# EAGLE design Xadow-Basic-Sensors-v1.0 (EAGLE 6.4)
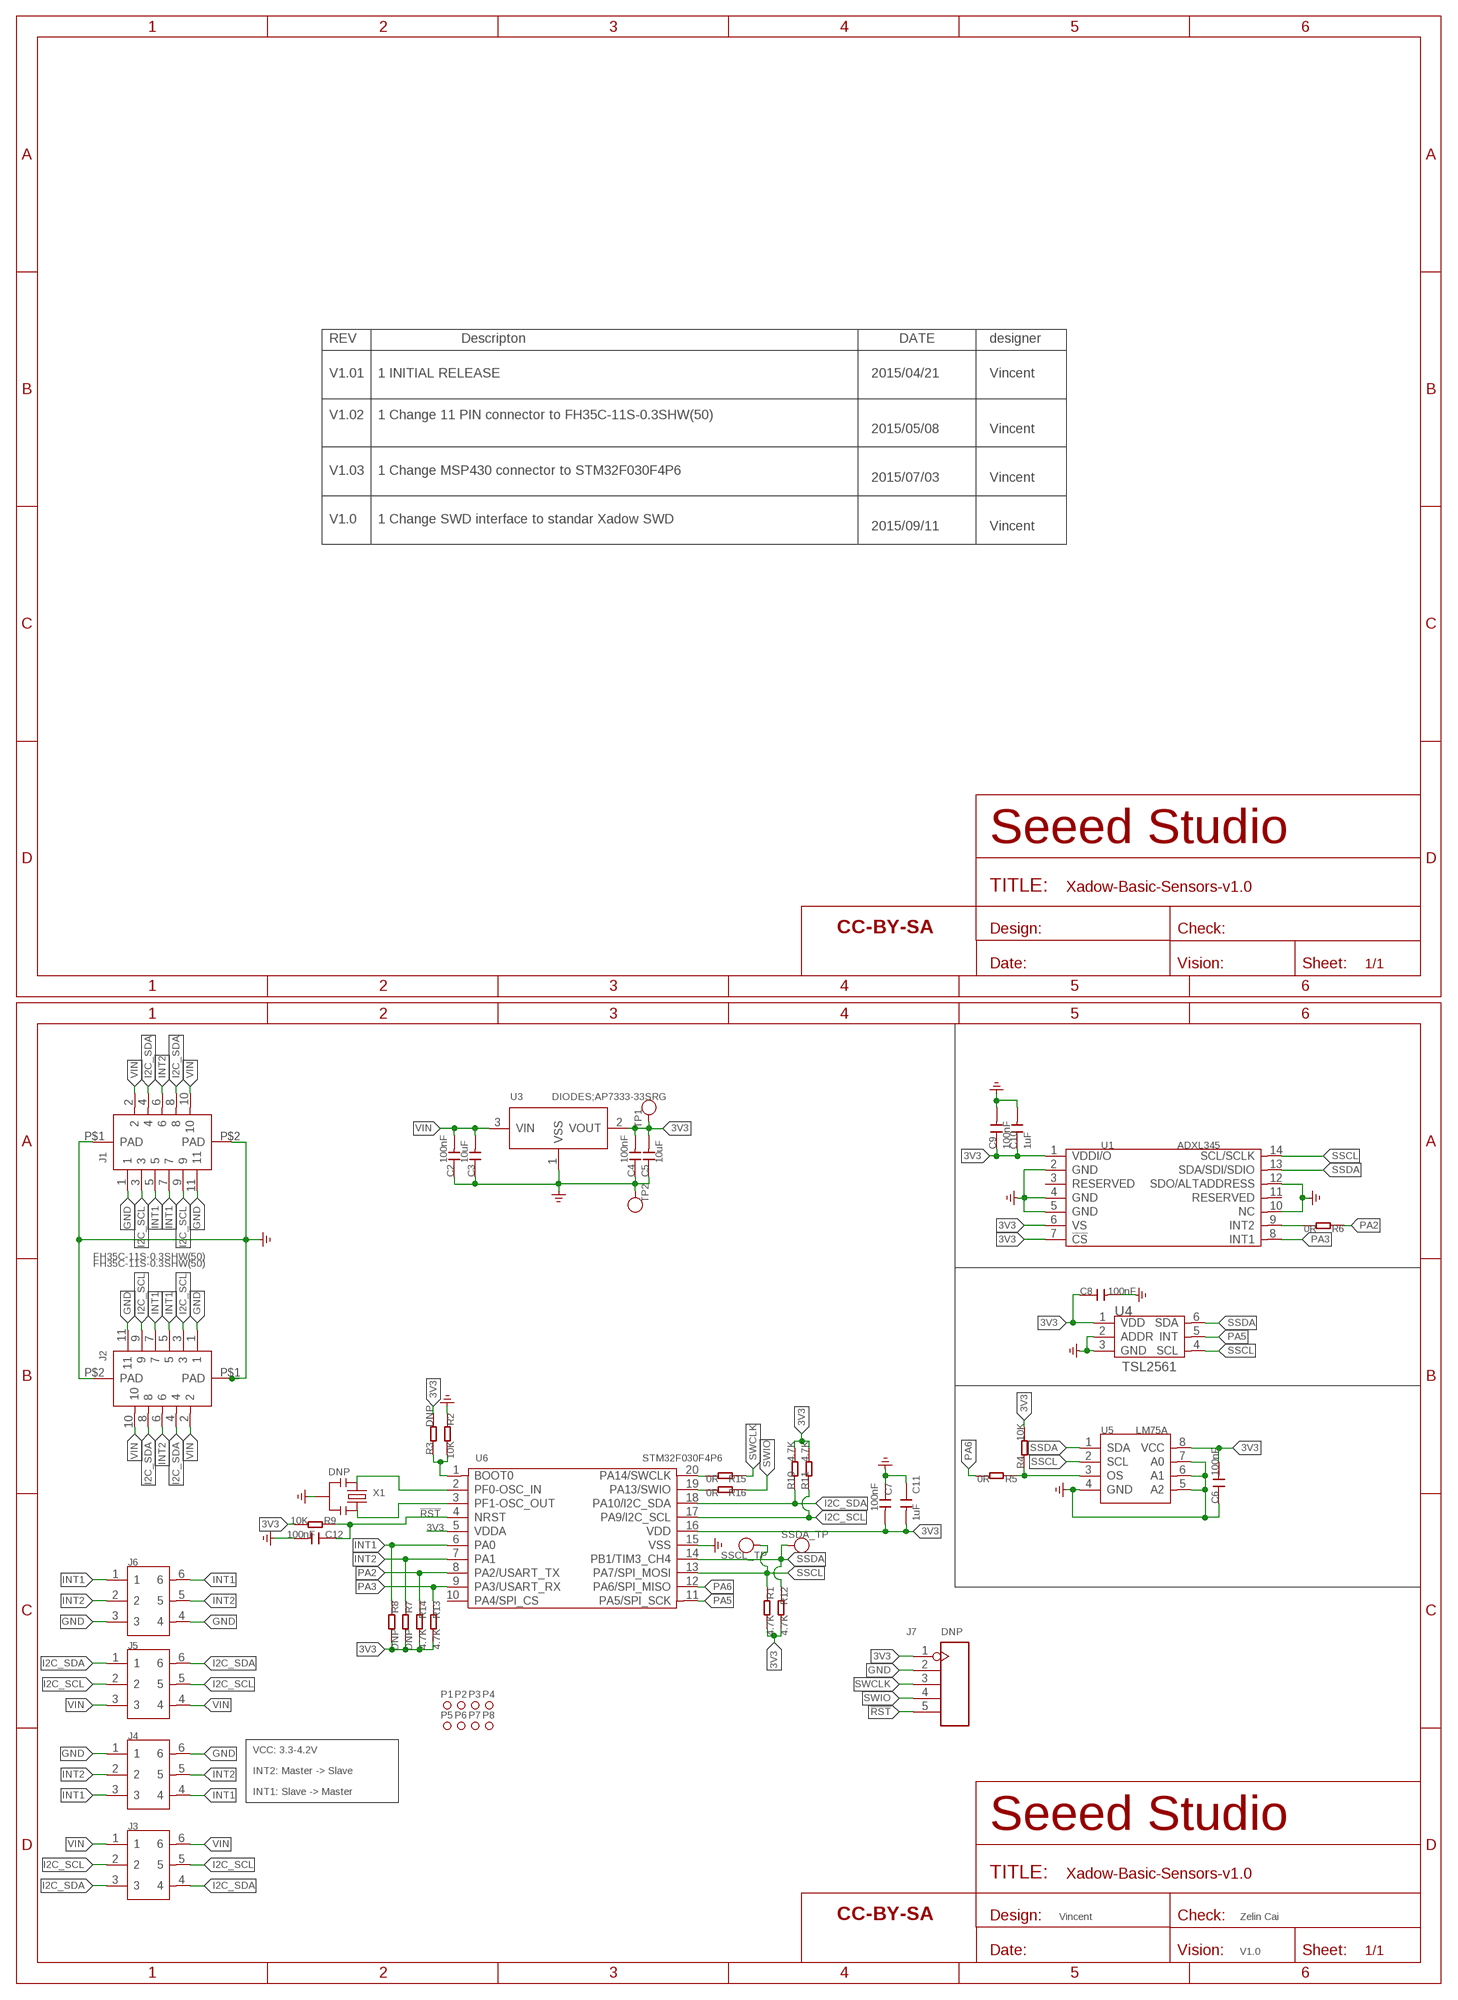
[diagram p0: schematic, sheet 1]

## Parts
C2  100nF  CAP-0402  [C0402]
C3  10uF  CAP-0603  [C0603]
C4  100nF  CAP-0402  [C0402]
C5  10uF  CAP-0603  [C0603]
C6  100nF  CAP-0402  [C0402]
C7  100nF  CAP-0402  [C0402]
C8  100nF  CAP-0402  [C0402]
C9  100nF  CAP-0402  [C0402]
C10  1uF  CAP-0402  [C0402]
C11  1uF  CAP-0402  [C0402]
C12  100nF  CAP-0402  [C0402]
FR1  SEEEDSTUDIO-OPEN-SCH-FRAME  [SEEEDSTUDIO-PCB-FRAME]
J1  FH35C-11S-0.3SHW(50)  FPC-CONNECTER-11P(FH35C-11S-0.3SHW(50))  [FPC11-SMD-0.3(FH35C)]
J2  FH35C-11S-0.3SHW(50)  FPC-CONNECTER-11P(FH35C-11S-0.3SHW(50))  [FPC11-SMD-0.3(FH35C)]
J3  HEADER6_S3  [6P-DIP-2_S3]
J4  HEADER6_ROUND  [6P-DIP-2_ROUND]
J5  HEADER6  [6P-DIP-2]
J6  HEADER6_ROUND  [6P-DIP-2_ROUND]
J7  DNP  HEADER-5PTEST  [H5-SMD-2.0-TEST]
P1  MARK-1.0'ANNULAR'  [ROUND-MARK-1.0]
P2  MARK-1.0'ANNULAR'  [ROUND-MARK-1.0]
P3  MARK-1.0'ANNULAR'  [ROUND-MARK-1.0]
P4  MARK-1.0'ANNULAR'  [ROUND-MARK-1.0]
P5  MARK-1.0'ANNULAR'  [ROUND-MARK-1.0]
P6  MARK-1.0'ANNULAR'  [ROUND-MARK-1.0]
P7  MARK-1.0'ANNULAR'  [ROUND-MARK-1.0]
P8  MARK-1.0'ANNULAR'  [ROUND-MARK-1.0]
R1  4.7K  RES-0402  [R0402]
R2  10K  RES-0402  [R0402]
R3  DNP  RES-0402  [R0402]
R4  10K  RES-0402  [R0402]
R5  0R  RES-0402  [R0402]
R6  0R  RES-0402  [R0402]
R7  DNP  RES-0402  [R0402]
R8  DNP  RES-0402  [R0402]
R9  10K  RES-0402  [R0402]
R10  4.7K  RES-0402  [R0402]
R11  4.7K  RES-0402  [R0402]
R12  4.7K  RES-0402  [R0402]
R13  4.7K  RES-0402  [R0402]
R14  4.7K  RES-0402  [R0402]
R15  0R  RES-0402  [R0402]
R16  0R  RES-0402  [R0402]
SSCL_TP  TEST-POINT'4545'  [TP-D45MIL]
SSDA_TP  TEST-POINT'4545'  [TP-D45MIL]
TP1  TEST-POINT'4545'  [TP-D45MIL]
TP2  TEST-POINT'4545'  [TP-D45MIL]
U1  ADXL345  SENSOR_ADXL345  [LGA14]
U3  DIODES;AP7333-33SRG  PMIC-XC6206PMR  [SOT-23]
U4  TSL2561  TSL2561T  [TMB-6]
U5  LM75A  SENSOR-LM75A  [TSSOP8-0.65-3X3MM]
U6  STM32F030F4P6  MCU-STM32F030  [TSSOP20-0.65-6.5X4.4MM]
U$2  SEEEDSTUDIO-OPEN-SCH-FRAME  [SEEEDSTUDIO-PCB-FRAME]
X1  DNP  CRYSTAL-RESONATOR'SMD'  [RESONATOR3-SMD-3.6X1.3X0.8MM]

## Nets
3V3: C4.2 C5.2 C6.2 C7.2 C8.1 C9.1 C10.1 C11.2 J7.1 R1.2 R3.2 R4.2 R7.2 R8.2 R9.2 R10.2 R11.2 R12.2 R13.2 R14.2 TP1.T U1.1(VDDI/O) U1.6(VS) U1.7(!CS) U3.2(VOUT) U4.1(VDD) U5.8(VCC) U6.5(VDDA) U6.16(VDD)
!RST: C12.1 J7.5 R9.1 U6.4(NRST)
GND: C2.1 C3.1 C4.1 C5.1 C6.1 C7.1 C8.2 C9.2 C10.2 C11.1 C12.2 J1.1 J1.11 J1.P$1(PAD) J1.P$2(PAD) J2.1 J2.11 J2.P$1(PAD) J2.P$2(PAD) J4.1 J4.6 J6.3 J6.4 J7.2 R2.1 TP2.T U1.2(GND) U1.4(GND) U1.5(GND) U1.10(NC) U1.12(SDO/ALTADDRESS) U3.1(VSS) U4.2(ADDR) U4.3(GND) U5.4(GND) U5.5(A2) U5.6(A1) U5.7(A0) U6.15(VSS) X1.2 ; supply symbol labelled GND_POWER
I2C_SCL: J1.3 J1.9 J2.3 J2.9 J3.2 J3.5 J5.2 J5.5 R11.1 U6.17(PA9/I2C_SCL)
I2C_SDA: J1.4 J1.8 J2.4 J2.8 J3.3 J3.4 J5.1 J5.6 R10.1 U6.18(PA10/I2C_SDA)
INT1: J1.5 J1.7 J2.5 J2.7 J4.3 J4.4 J6.1 J6.6 R8.1 U6.6(PA0)
INT2: J1.6 J2.6 J4.2 J4.5 J6.2 J6.5 R7.1 U6.7(PA1)
N$1: R6.2 U1.9(INT2)
N$2: U6.2(PF0-OSC_IN) X1.3
N$3: R4.1 R5.1 U5.3(OS)
N$4: U6.3(PF1-OSC_OUT) X1.1
N$6: R2.2 R3.1 U6.1(BOOT0)
N$7: R15.2 U6.20(PA14/SWCLK)
N$8: R16.2 U6.19(PA13/SWIO)
PA2: R6.1 R14.1 U6.8(PA2/USART_TX)
PA3: R13.1 U1.8(INT1) U6.9(PA3/USART_RX)
PA5: U4.5(INT) U6.11(PA5/SPI_SCK)
PA6: R5.2 U6.12(PA6/SPI_MISO)
SSCL: R1.1 SSCL_TP.T U1.14(SCL/SCLK) U4.4(SCL) U5.2(SCL) U6.13(PA7/SPI_MOSI)
SSDA: R12.1 SSDA_TP.T U1.13(SDA/SDI/SDIO) U4.6(SDA) U5.1(SDA) U6.14(PB1/TIM3_CH4)
SWCLK: J7.3 R15.1
SWIO: J7.4 R16.1
VIN: C2.2 C3.2 J1.2 J1.10 J2.2 J2.10 J3.1 J3.6 J5.3 J5.4 U3.3(VIN)
Unconnected: U1.3(RESERVED) U1.11(RESERVED) U6.10(PA4/SPI_CS)

## Notes on the sheet
- REV | Descripton | DATE | designer
- V1.01 | 1 INITIAL RELEASE | 2015/04/21 | Vincent
- V1.02 | 1 Change 11 PIN connector to FH35C-11S-0.3SHW(50)
- 2015/05/08 | Vincent
- V1.03 | 1 Change MSP430 connector to STM32F030F4P6
- 2015/07/03 | Vincent
- V1.0 | 1 Change SWD interface to standar Xadow SWD
- 2015/09/11 | Vincent
- VCC: 3.3-4.2V
- INT2: Master -> Slave
- INT1: Slave -> Master
- Vincent | Zelin Cai
- V1.0

## Library data of the parts
C2-C12 = Discrete-new:CAP: Ceramic Capacitors
FR1 U$2 = moudle-new:SEEEDSTUDIO-OPEN-SCH-FRAME
J1 J2 = template:FPC-CONNECTER-11P(FH35C-11S-0.3SHW(50))
J3 = Connector:HEADER6_S3
J4 J6 = template:HEADER6_ROUND
J5 = template:HEADER6
J7 = Connector-new:HEADER-5P
P1-P8 = Discrete-new:MARK-1.0; PARTNO: DNP
R1-R16 = Discrete-new:RES
SSCL_TP SSDA_TP TP1 TP2 = Discrete-new:TEST-POINT; PARTNO: DNP
U1 = template:SENSOR_ADXL345: 314080008
U3 = IC-new:PMIC-XC6206P: LOW ESR Cap.Compatible Positive Voltage Regulators
U4 = template:TSL2561: Light-TO-Digital Converter
U5 = template:SENSOR-LM75A: Digital temperature sensor and thermal watchdog
U6 = IC-new:MCU-STM32F030
X1 = Discrete-new:CRYSTAL-RESONATOR: Resonator Small SMD resonator. This is the itty bitty 10/20MHz resonators with built in caps. CSTCE10M0G55 and CSTCE20M0V53. Footprint has been reviewed closely but hasn't been tested yet.

## Board
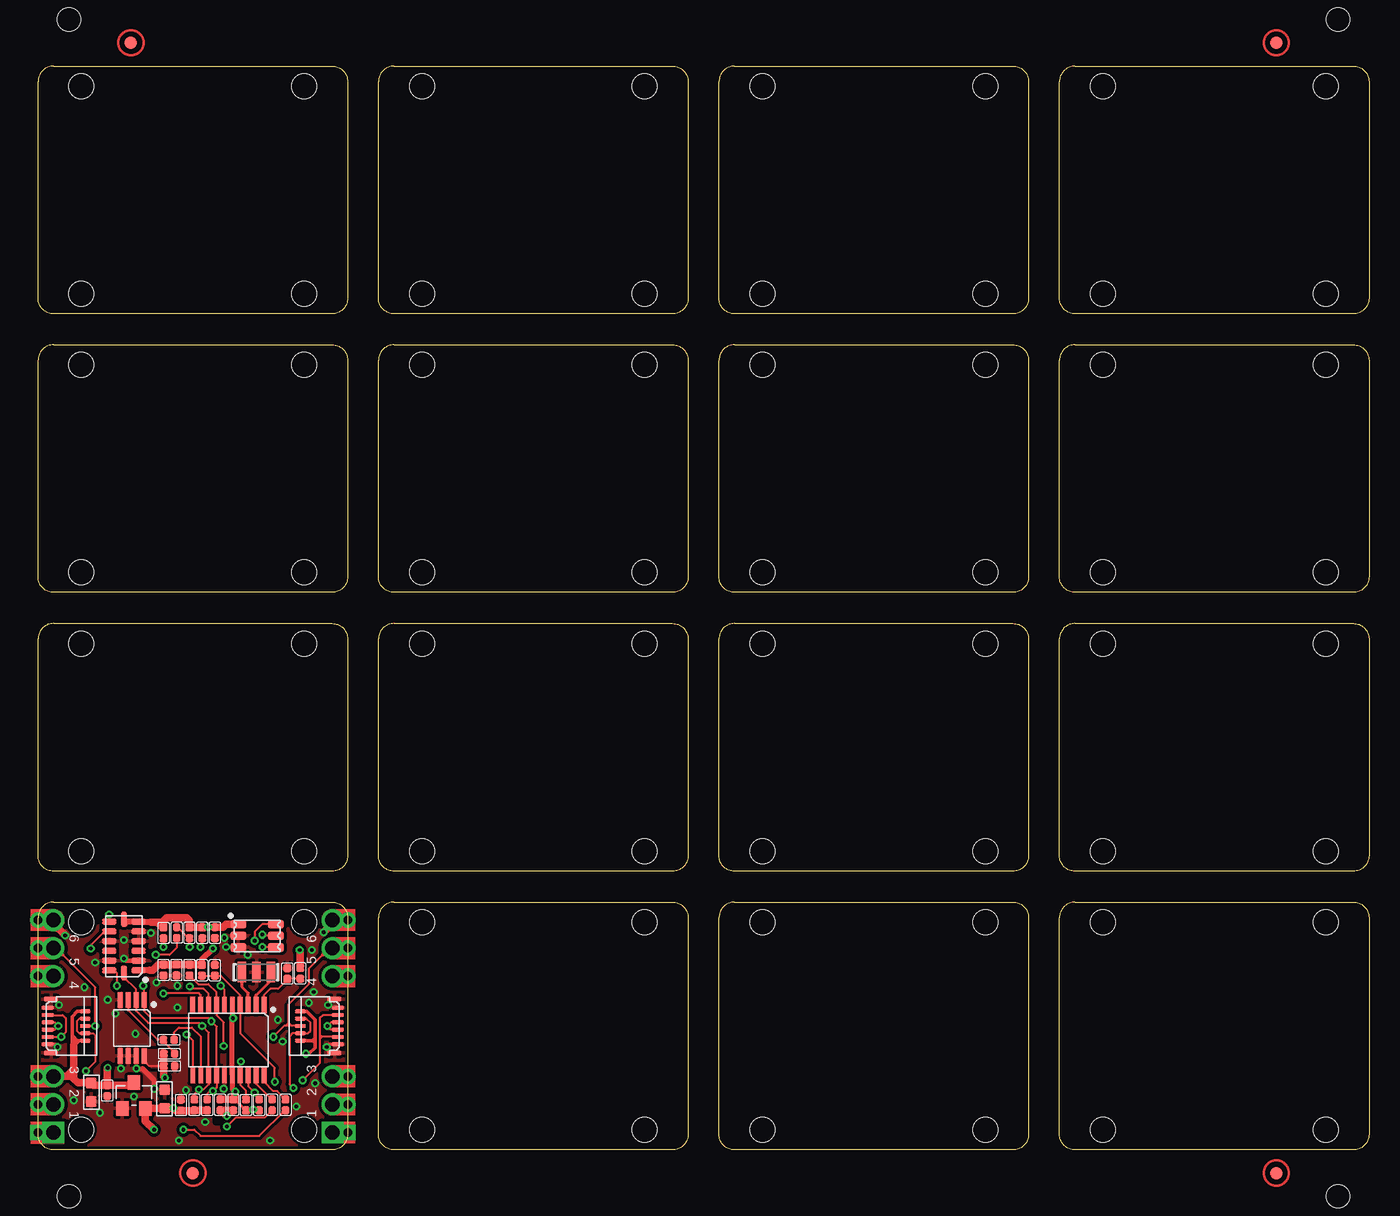
[diagram p1: board, top side]
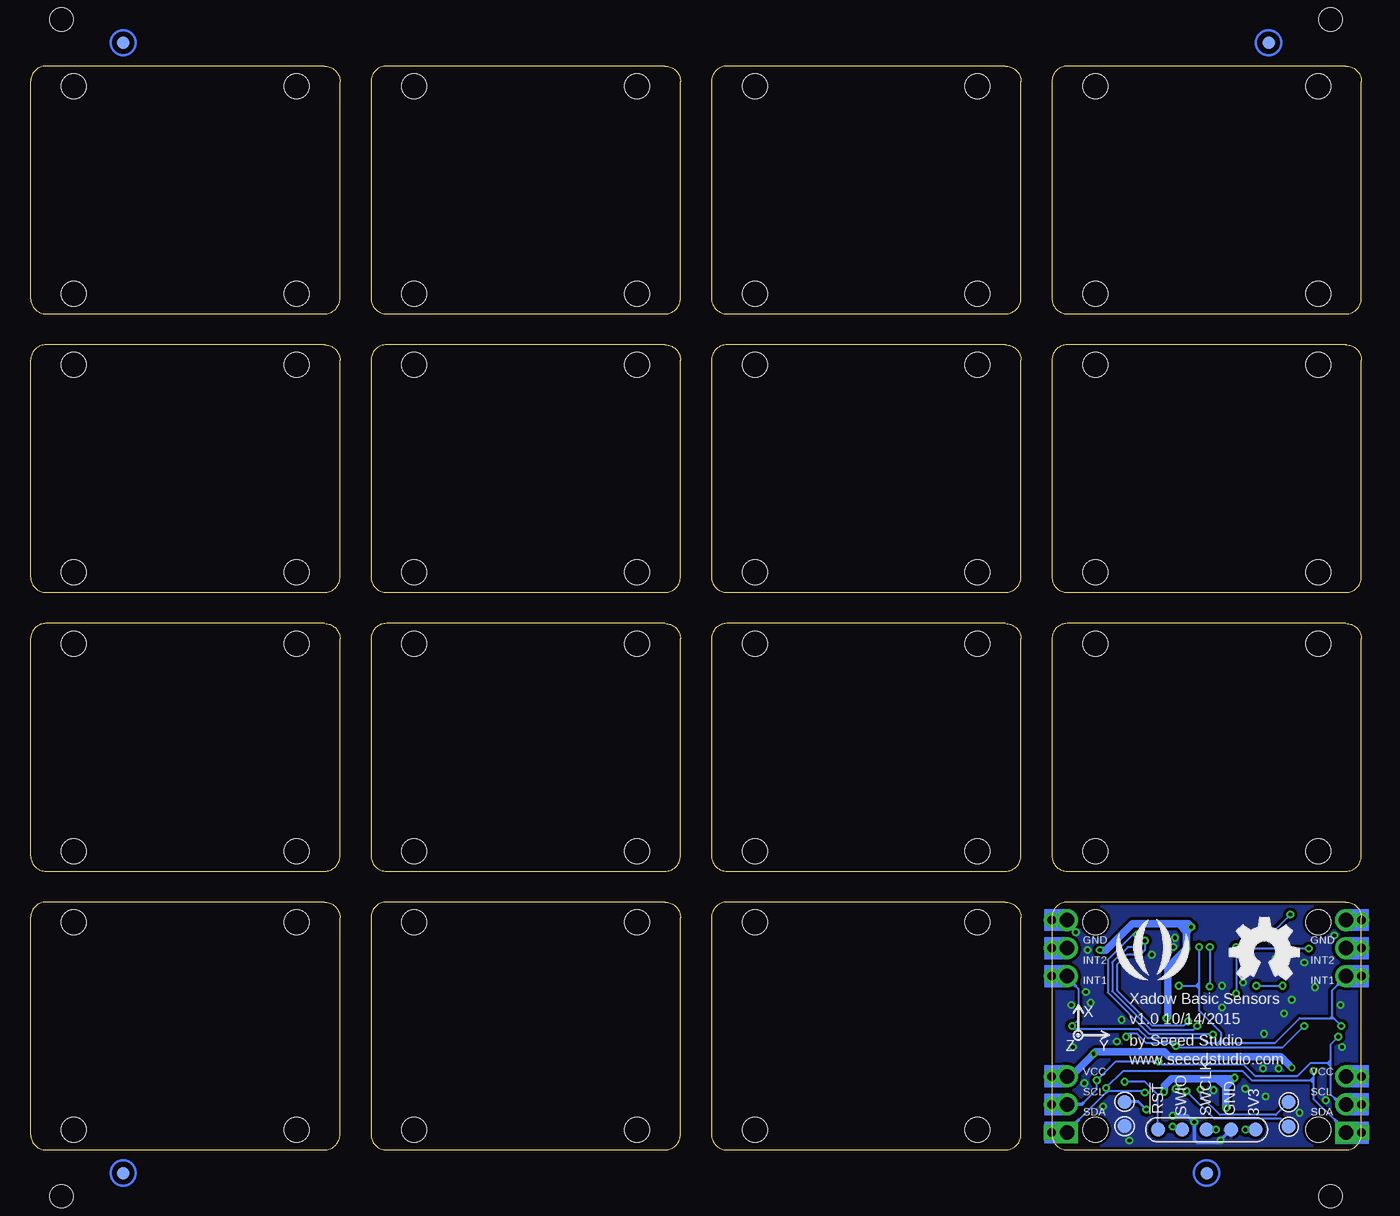
[diagram p2: board, bottom side, seen from below]

Size 109.22 x 88.9 mm. Coordinates in mm from the lower left corner, seen from the top.
Outline: 1.27,0 arc-90 0,1.27
Outline: 24.13,20.32 arc-90 25.4,19.05
Outline: 25.4,1.27 arc-90 24.13,0
Outline: 24.13,0 1.27,0
Outline: 1.27,0 arc-90 0,1.27
Outline: 0,1.27 0,19.05 arc-90 1.27,20.32 24.13,20.32
Outline: 24.13,20.32 arc-90 25.4,19.05
Outline: 25.4,1.27 arc-90 24.13,0
Outline: 25.4,19.05 25.4,1.27
Outline: 29.21,0 arc-90 27.94,1.27
Outline: 52.07,20.32 arc-90 53.34,19.05
Outline: 53.34,1.27 arc-90 52.07,0
Outline: 52.07,0 29.21,0
Outline: 29.21,0 arc-90 27.94,1.27
Outline: 27.94,1.27 27.94,19.05 arc-90 29.21,20.32 52.07,20.32
Outline: 52.07,20.32 arc-90 53.34,19.05
Outline: 53.34,1.27 arc-90 52.07,0
Outline: 53.34,19.05 53.34,1.27
Outline: 1.27,22.86 arc-90 0,24.13
Outline: 24.13,43.18 arc-90 25.4,41.91
Outline: 25.4,24.13 arc-90 24.13,22.86
Outline: 24.13,22.86 1.27,22.86
Outline: 1.27,22.86 arc-90 0,24.13
Outline: 0,24.13 0,41.91 arc-90 1.27,43.18 24.13,43.18
Outline: 24.13,43.18 arc-90 25.4,41.91
Outline: 25.4,24.13 arc-90 24.13,22.86
Outline: 25.4,41.91 25.4,24.13
Outline: 29.21,22.86 arc-90 27.94,24.13
Outline: 52.07,43.18 arc-90 53.34,41.91
Outline: 53.34,24.13 arc-90 52.07,22.86
Outline: 52.07,22.86 29.21,22.86
Outline: 29.21,22.86 arc-90 27.94,24.13
Outline: 27.94,24.13 27.94,41.91 arc-90 29.21,43.18 52.07,43.18
Outline: 52.07,43.18 arc-90 53.34,41.91
Outline: 53.34,24.13 arc-90 52.07,22.86
Outline: 53.34,41.91 53.34,24.13
Outline: 57.15,0 arc-90 55.88,1.27
Outline: 80.01,20.32 arc-90 81.28,19.05
Outline: 81.28,1.27 arc-90 80.01,0
Outline: 80.01,0 57.15,0
Outline: 57.15,0 arc-90 55.88,1.27
Outline: 55.88,1.27 55.88,19.05 arc-90 57.15,20.32 80.01,20.32
Outline: 80.01,20.32 arc-90 81.28,19.05
Outline: 81.28,1.27 arc-90 80.01,0
Outline: 81.28,19.05 81.28,1.27
Outline: 85.09,0 arc-90 83.82,1.27
Outline: 107.95,20.32 arc-90 109.22,19.05
Outline: 109.22,1.27 arc-90 107.95,0
Outline: 107.95,0 85.09,0
Outline: 85.09,0 arc-90 83.82,1.27
Outline: 83.82,1.27 83.82,19.05 arc-90 85.09,20.32 107.95,20.32
Outline: 107.95,20.32 arc-90 109.22,19.05
Outline: 109.22,1.27 arc-90 107.95,0
Outline: 109.22,19.05 109.22,1.27
Outline: 57.15,22.86 arc-90 55.88,24.13
Outline: 80.01,43.18 arc-90 81.28,41.91
Outline: 81.28,24.13 arc-90 80.01,22.86
Outline: 80.01,22.86 57.15,22.86
Outline: 57.15,22.86 arc-90 55.88,24.13
Outline: 55.88,24.13 55.88,41.91 arc-90 57.15,43.18 80.01,43.18
Outline: 80.01,43.18 arc-90 81.28,41.91
Outline: 81.28,24.13 arc-90 80.01,22.86
Outline: 81.28,41.91 81.28,24.13
Outline: 85.09,22.86 arc-90 83.82,24.13
Outline: 107.95,43.18 arc-90 109.22,41.91
Outline: 109.22,24.13 arc-90 107.95,22.86
Outline: 107.95,22.86 85.09,22.86
Outline: 85.09,22.86 arc-90 83.82,24.13
Outline: 83.82,24.13 83.82,41.91 arc-90 85.09,43.18 107.95,43.18
Outline: 107.95,43.18 arc-90 109.22,41.91
Outline: 109.22,24.13 arc-90 107.95,22.86
Outline: 109.22,41.91 109.22,24.13
Outline: 1.27,45.72 arc-90 0,46.99
Outline: 24.13,66.04 arc-90 25.4,64.77
Outline: 25.4,46.99 arc-90 24.13,45.72
Outline: 24.13,45.72 1.27,45.72
Outline: 1.27,45.72 arc-90 0,46.99
Outline: 0,46.99 0,64.77 arc-90 1.27,66.04 24.13,66.04
Outline: 24.13,66.04 arc-90 25.4,64.77
Outline: 25.4,46.99 arc-90 24.13,45.72
Outline: 25.4,64.77 25.4,46.99
Outline: 29.21,45.72 arc-90 27.94,46.99
Outline: 52.07,66.04 arc-90 53.34,64.77
Outline: 53.34,46.99 arc-90 52.07,45.72
Outline: 52.07,45.72 29.21,45.72
Outline: 29.21,45.72 arc-90 27.94,46.99
Outline: 27.94,46.99 27.94,64.77 arc-90 29.21,66.04 52.07,66.04
Outline: 52.07,66.04 arc-90 53.34,64.77
Outline: 53.34,46.99 arc-90 52.07,45.72
Outline: 53.34,64.77 53.34,46.99
Outline: 1.27,68.58 arc-90 0,69.85
Outline: 24.13,88.9 arc-90 25.4,87.63
Outline: 25.4,69.85 arc-90 24.13,68.58
Outline: 24.13,68.58 1.27,68.58
Outline: 1.27,68.58 arc-90 0,69.85
Outline: 0,69.85 0,87.63 arc-90 1.27,88.9 24.13,88.9
Outline: 24.13,88.9 arc-90 25.4,87.63
Outline: 25.4,69.85 arc-90 24.13,68.58
Outline: 25.4,87.63 25.4,69.85
Outline: 29.21,68.58 arc-90 27.94,69.85
Outline: 52.07,88.9 arc-90 53.34,87.63
Outline: 53.34,69.85 arc-90 52.07,68.58
Outline: 52.07,68.58 29.21,68.58
Outline: 29.21,68.58 arc-90 27.94,69.85
Outline: 27.94,69.85 27.94,87.63 arc-90 29.21,88.9 52.07,88.9
Outline: 52.07,88.9 arc-90 53.34,87.63
Outline: 53.34,69.85 arc-90 52.07,68.58
Outline: 53.34,87.63 53.34,69.85
Outline: 57.15,45.72 arc-90 55.88,46.99
Outline: 80.01,66.04 arc-90 81.28,64.77
Outline: 81.28,46.99 arc-90 80.01,45.72
Outline: 80.01,45.72 57.15,45.72
Outline: 57.15,45.72 arc-90 55.88,46.99
Outline: 55.88,46.99 55.88,64.77 arc-90 57.15,66.04 80.01,66.04
Outline: 80.01,66.04 arc-90 81.28,64.77
Outline: 81.28,46.99 arc-90 80.01,45.72
Outline: 81.28,64.77 81.28,46.99
Outline: 85.09,45.72 arc-90 83.82,46.99
Outline: 107.95,66.04 arc-90 109.22,64.77
Outline: 109.22,46.99 arc-90 107.95,45.72
Outline: 107.95,45.72 85.09,45.72
Outline: 85.09,45.72 arc-90 83.82,46.99
Outline: 83.82,46.99 83.82,64.77 arc-90 85.09,66.04 107.95,66.04
Outline: 107.95,66.04 arc-90 109.22,64.77
Outline: 109.22,46.99 arc-90 107.95,45.72
Outline: 109.22,64.77 109.22,46.99
Outline: 57.15,68.58 arc-90 55.88,69.85
Outline: 80.01,88.9 arc-90 81.28,87.63
Outline: 81.28,69.85 arc-90 80.01,68.58
Outline: 80.01,68.58 57.15,68.58
Outline: 57.15,68.58 arc-90 55.88,69.85
Outline: 55.88,69.85 55.88,87.63 arc-90 57.15,88.9 80.01,88.9
Outline: 80.01,88.9 arc-90 81.28,87.63
Outline: 81.28,69.85 arc-90 80.01,68.58
Outline: 81.28,87.63 81.28,69.85
Outline: 85.09,68.58 arc-90 83.82,69.85
Outline: 107.95,88.9 arc-90 109.22,87.63
Outline: 109.22,69.85 arc-90 107.95,68.58
Outline: 107.95,68.58 85.09,68.58
Outline: 85.09,68.58 arc-90 83.82,69.85
Outline: 83.82,69.85 83.82,87.63 arc-90 85.09,88.9 107.95,88.9
Outline: 107.95,88.9 arc-90 109.22,87.63
Outline: 109.22,69.85 arc-90 107.95,68.58
Outline: 109.22,87.63 109.22,69.85
Copper layers (1*16): Top 0.035mm / dielectric 1.5mm / Bottom 0.035mm
Design rules "SeeedStudio_2layer_DRU_no_angle_20140221 *": minimum track width 1mil, minimum drill 12mil, track to track 6mil, track to pad 6mil, pad to pad 6mil, via to via 6mil, smd to smd 0mil, copper to edge 10mil, drill to drill 10mil, minimum pad ring 10mil, minimum via ring 6mil, stop-mask expansion 2mil, vias tented up to drill 25mil, thermal gap 10mil
Holes 2.03 mm at 3.56,1.65 3.56,18.67 21.84,18.67 21.84,1.65 49.78,1.65 49.78,18.67 31.5,18.67 31.5,1.65 21.84,24.51 21.84,41.53 3.56,41.53 3.56,24.51 49.78,24.51 49.78,41.53 31.5,41.53 31.5,24.51 77.72,1.65 77.72,18.67 59.44,18.67 59.44,1.65 105.66,1.65 105.66,18.67 87.38,18.67 87.38,1.65 77.72,24.51 77.72,41.53 59.44,41.53 59.44,24.51 105.66,24.51 105.66,41.53 87.38,41.53 87.38,24.51 21.84,47.37 21.84,64.39 3.56,64.39 3.56,47.37 49.78,47.37 49.78,64.39 31.5,64.39 31.5,47.37 21.84,70.23 21.84,87.25 3.56,87.25 3.56,70.23 49.78,70.23 49.78,87.25 31.5,87.25 31.5,70.23 77.72,47.37 77.72,64.39 59.44,64.39 59.44,47.37 105.66,47.37 105.66,64.39 87.38,64.39 87.38,47.37 77.72,70.23 77.72,87.25 59.44,87.25 59.44,70.23 105.66,70.23 105.66,87.25 87.38,87.25 87.38,70.23
Holes 1.91 mm at 2.54,-3.81 106.68,-3.81 106.68,92.71 2.54,92.71
tRestrict: area 14.6,2.3 to 16.8,3.8

### Footprints (pad centres in the part's own frame; a part is rotated, then mirrored left to right if it is on the bottom)
C0402 = smd 0.635 x 0.635: 1 0,0.445; 2 0,-0.445
C0603 = smd 0.889 x 0.889: 1 0,0.762; 2 0,-0.762
FPC11-SMD-0.3(FH35C) = smd 0.3 x 1: 1 -1.5,-3.075; 3 -0.9,-3.075; 5 -0.3,-3.075; 7 0.3,-3.075; 9 0.9,-3.075; 11 1.5,-3.075 | smd 0.3 x 0.85: 2 -1.2,0; 4 -0.6,0; 6 0,0; 8 0.6,0; 10 1.2,0 | smd 0.4 x 1.15: P$1 2.2,-2.8; P$2 -2.2,-2.8
6P-DIP-2_S3 = drill 0.7 pad 1.27: 1 -2.3,0; 2 0,0 | drill 0.7 pad 1.27 square: 3 2.3,0 | drill 1.2 pad 1.8 square: 4 2.3,1.25 | drill 1.2 pad 1.8: 5 0,1.25; 6 -2.3,1.25
6P-DIP-2_ROUND = drill 0.7 pad 1.27: 1 -2.3,0; 2 0,0; 3 2.3,0 | drill 1.2 pad 1.8: 4 2.3,1.25; 5 0,1.25; 6 -2.3,1.25
6P-DIP-2 = drill 0.7 pad 1.27 square: 1 -2.3,0 | drill 0.7 pad 1.27: 2 0,0; 3 2.3,0 | drill 1.2 pad 1.8: 4 2.3,1.25; 5 0,1.25 | drill 1.2 pad 1.8 square: 6 -2.3,1.25
H5-SMD-2.0-TEST = smd 1.143 x 1.143: 1 0,4; 2 0,2; 3 0,0; 4 0,-2; 5 0,-4
ROUND-MARK-1.0 = smd 1.016 x 1.016: P$1 0,0
R0402 = smd 0.635 x 0.635: 1 0,0.445; 2 0,-0.445
TP-D45MIL = smd 1.143 x 1.143: T 0,0
LGA14 = smd 1.2 x 0.5: 1 -1.2,2; 2 -1.2,1.2; 3 -1.2,0.4; 4 -1.2,-0.4; 5 -1.2,-1.2; 6 -1.2,-2; 8 1.2,-2; 9 1.2,-1.2; 10 1.2,-0.4; 11 1.2,0.4; 12 1.2,1.2; 13 1.2,2 | smd 0.5 x 1.2: 7 0,-2.2; 14 0,2.2
SOT-23 = smd 1.016 x 1.2: 1 -0.95,-1.06; 2 0.95,-1.06; 3 0,1.06
TMB-6 = smd 1.3 x 0.7: 1 -1.55,0.95; 2 -1.55,0; 3 -1.55,-0.95; 4 1.55,-0.95; 5 1.55,0; 6 1.55,0.95
TSSOP8-0.65-3X3MM = smd 0.4 x 1.27: 1 -0.975,-2.3; 2 -0.325,-2.3; 3 0.325,-2.3; 4 0.975,-2.3; 5 0.975,2.3; 6 0.325,2.3; 7 -0.325,2.3; 8 -0.975,2.3
TSSOP20-0.65-6.5X4.4MM = smd 0.4 x 1.35: 1 -2.925,-2.875; 2 -2.275,-2.875; 3 -1.625,-2.875; 4 -0.975,-2.875; 5 -0.325,-2.875; 6 0.325,-2.875; 7 0.975,-2.875; 8 1.625,-2.875; 9 2.275,-2.875; 10 2.925,-2.875; 11 2.91,2.875; 12 2.26,2.875; 13 1.61,2.875; 14 0.96,2.875; 15 0.325,2.875; 16 -0.325,2.875; 17 -0.975,2.875; 18 -1.625,2.875; 19 -2.275,2.875; 20 -2.925,2.875
RESONATOR3-SMD-3.6X1.3X0.8MM = smd 0.7 x 1.7: 1 -1.2,0; 2 0,0; 3 1.2,0

### Placement (x,y rotation side)
C2  5.68,4.86 180 top
C3  4.37,4.72 180 top
C4  11.72,3.67 0 top
C5  10.39,4.18 0 top
C6  10.77,6.87 270 top
C7  16.03,3.7 180 top
C8  14.52,17.81 0 top
C9  10.3,14.74 0 top
C10  11.35,14.76 0 top
C11  14.95,3.7 180 top
C12  14.5,14.73 180 top
FR1  -69.72,-83.44 0 top  (outside the outline)
J1  21.53,10.16 90 top
J2  3.87,10.16 270 top
J3  0.01,3.72 270 top
J4  0.01,16.55 270 top
J5  25.41,3.72 90 top
J6  25.41,16.55 90 top
J7  12.7,1.65 270 bottom
P1  12.7,-1.9 90 top
P2  101.6,-1.9 90 top
P3  101.6,90.81 90 top
P4  7.62,90.81 90 top
P5  12.7,-1.9 270 bottom
P6  101.6,-1.9 270 bottom
P7  101.6,90.81 270 bottom
P8  7.62,90.81 270 bottom
R1  12.83,3.7 0 top
R2  20.45,14.47 0 top
R3  21.51,14.48 180 top
R4  10.77,7.89 270 top
R5  10.73,9.02 90 top
R6  11.38,17.82 0 top
R7  12.43,14.74 180 top
R8  13.47,17.81 180 top
R9  13.46,14.73 180 top
R10  18.15,3.68 0 top
R11  17.07,3.68 0 top
R12  13.88,3.68 0 top
R13  10.3,17.79 180 top
R14  12.42,17.81 180 top
R15  20.31,3.7 180 top
R16  19.22,3.7 180 top
SSCL_TP  5.97,3.91 270 bottom
SSDA_TP  5.97,1.91 270 bottom
TP1  19.43,3.94 180 bottom
TP2  19.43,1.94 180 bottom
U1  7.05,16.71 180 top
U3  7.86,4.46 0 top
U4  17.98,17.55 0 top
U5  7.72,10.01 180 top
U6  15.62,9.02 180 top
U$2  0.76,-76.83 0 top  (outside the outline)
U$18  [OSHW_FILLX200_NOTEXT]  10.79,13.97 0 bottom
U$20  [SEEED-SILK-280*268MIL]  17.15,15.62 0 bottom
X1  17.92,14.58 0 top

### Tracks (layer width: path | path; a pad name or v marks a point on that pad's centre or on a via)
3V3  (via drill 0.3, 0.3 pad 0.64)
  Top 0.152: C6.2 9.13,6.87 8.7,7.31 8.7,7.56
  Top 0.254: C7.2 16.12,4.14 17.02,3.24 R11.2 17.59,3.24 v17.65,3.3 17.72,3.24 R10.2
  Top 0.305: U5.8 8.7,7.56
  Top 0.406: U6.5 15.95,10.85 v16,10.79 15.95,10.74 U6.16 15.95,5.01 v16.19,4.76
  Top 0.508: 9.27,18.67 9.23,18.71 U1.6 7.28,18.71 | 7.28,18.71 7.25,18.71 U1.7 | 7.28,18.71 7.11,18.54 | 9.14,14.73 8.27,14.73 U1.1 | R9.2 13.46,15.62 v14.35,16.51 | R8.2 13.93,18.25 v13.97,18.29 14,18.26 C8.1
  Top 0.61: U3.2 10.37,3.4 C5.2 11.1,3.42 v11.11,3.43 11.32,3.23 C4.2 12.8,3.23 R1.2 13.87,3.25 R12.2 | C11.2 C7.2 | 10.21,18.24 R13.2 10.3,18.67 | R8.2 R14.2 12.42,18.82 12.19,19.05 10.54,19.05 10.3,18.81 10.3,18.67 | 9.78,18.67 10.3,18.67 | 9.27,18.67 9.78,18.67 | 9.78,18.67 10.16,18.29 | U4.1 15.46,18.5 15.21,18.26 C8.1 | R9.2 R7.2 11.37,15.19 C10.1 10.31,15.2 C9.1 9.86,15.19 9.4,14.73 9.14,14.73 | R3.2 21.51,16.33 v21.46,16.38 | R4.2 C6.2 10.31,6.86 10.31,6.01 v10.41,5.91 | 16.12,4.14 16.12,4.69 v16.19,4.76 | 8.7,3.29 U3.2 | U3.2 8.81,2.37 v9.53,1.65
  Bottom 0.254: v17.65,3.3 18.29,3.94 TP1.T
  Bottom 0.508: J7.1 v9.53,1.65
  Bottom 0.61: 11.81,5.84 15.62,5.84 16.19,5.27 v16.19,4.76 | 11.81,5.84 11.05,5.84 | 11.05,5.84 10.48,5.84 v10.41,5.91 11.11,5.21 | 14.99,18.54 18.8,18.54 20.96,16.38 v21.46,16.38 | 14.99,18.54 14.35,18.54 | 14.35,18.54 14.22,18.54 v13.97,18.29 14.35,17.91 | 14.35,17.91 v14.35,16.51 15.88,14.99 15.88,10.92 v16,10.79 | 14.35,17.91 14.35,18.54 | 14.35,17.91 14.99,18.54 | v11.11,3.43 11.11,5.21 | 11.11,5.21 11.11,5.78 11.05,5.84 | 11.11,5.21 11.18,5.21 11.81,5.84
  pour Top (isolate 0.254, no thermals): 8.51,7.11 8.89,7.11 9.27,6.73 10.48,6.73 10.6,6.86 10.6,8.13 10.54,8.19 8.57,8.19 8.45,8.06 8.45,7.18
!RST  (via drill 0.3 pad 0.64)
  Top 0.152: R9.1 C12.1 14.99,14.29 16.6,12.68 U6.4 16.6,9.57 19.43,6.73 v19.43,5.59
  Bottom 0.152: J7.5 16.7,4.51 17.78,5.59 v19.43,5.59
GND  (via drill 0.3 pad 0.64)
  Top 0.305: J1.P$2 23.92,7.96 23.69,8.19 v23.69,8.45 23.9,8.66 J1.1 | J2.11 1.37,8.66 v1.59,8.45
  Top 0.356: U1.2 7.22,15.51 v7.05,15.69
  Top 0.406: v9.53,5.02 9.53,5.72 8.57,6.67 v8.06,6.67
  Top 0.61: v23.43,17.84 24.16,18.58 J6.4 J6.3 | J4.6 1.26,18.55 v2.22,17.59 | C7.1 15.95,3.25 v15.49,2.79 15.04,3.25 C11.1 15.99,3.25 16,3.24
  Bottom 0.305: v15.49,2.79 14.29,2.79 13.72,2.22 13.72,0.83 13.46,0.57 11.78,0.57 J7.2
  other vias: 6.35,11.18 4.7,15.37 7.05,17.21 9.27,17.78 11.43,13.46 9.72,13.72 15.3,17.4 15.43,16.64 17.21,16 23.81,11.87 1.71,11.87 6.79,6.67 12.13,4.89 15.24,5.02 22.23,12.06 22.48,16.38 3.81,13.33 22.61,12.95 22.73,5.46 21.21,3.56 7.87,4.38 11.43,11.68 5.71,12.32 8,9.53 19.69,10.67 20.07,8.89 19.05,0.76 5.08,3.05 2.92,4.06 13.72,2.29 11.56,0.76
  pour Top (isolate 0.254, rank 6): -0.64,20.96 26.04,20.96 26.04,-0.63 -0.64,-0.63
  pour Bottom (isolate 0.254, rank 6): -0.64,20.96 26.04,20.96 26.04,-0.63 -0.64,-0.63
I2C_SCL  (via drill 0.3 pad 0.64)
  Top 0.152: J2.3 2.02,11.06 2.29,10.79 2.29,9.65 v1.91,9.27 1.89,9.26 J2.9 | R11.1 17.07,4.86 16.6,5.33 U6.17 16.6,7.2 v16.64,7.24 | J1.9 23.38,11.06 23.11,10.79 23.11,9.4 | 23.11,9.4 23.11,9.27 | 23.11,9.27 23.11,9.08 | 23.11,9.08 23.11,7.11 v21.72,5.72 | J1.3 23.29,9.26 | 23.25,9.26 23.12,9.26 23.11,9.27 | 23.29,9.26 23.25,9.26 | 23.25,9.26 23.11,9.4 | 23.29,9.26 23.11,9.08
  Bottom 0.152: 2.16,4.19 2.54,4.57 2.54,6.86 | 2.54,7.11 2.79,7.11 | 2.79,7.11 4.19,7.11 5.21,6.1 8.76,6.1 9.65,6.99 16.38,6.99 v16.64,7.24 20.19,7.24 v21.72,5.72 21.72,4.95 22.86,3.81 | v1.91,9.27 2.54,8.64 2.54,7.37 | 2.54,7.37 2.54,7.11 | 2.54,7.11 2.54,6.86 | 2.79,7.11 2.54,7.37 | 2.79,7.11 2.54,6.86
  Bottom 0.305: 22.86,3.81 22.95,3.72 J5.5 J5.2 | 2.16,4.19 1.69,3.72 J3.5 J3.2
I2C_SDA  (via drill 0.3 pad 0.64)
  Top 0.152: J2.4 3.39,10.76 3.17,10.54 3.17,9.78 3.39,9.56 J2.8 4.54,9.56 4.7,9.4 4.7,7.24 v3.94,6.48 | J1.8 22.01,10.76 22.35,10.41 22.35,9.78 22.13,9.56 J1.4 20.86,9.56 20.64,9.33 20.64,5.4 v20.96,5.08 | U6.18 17.25,5.23 v17.78,4.7 17.78,4.5 R10.1
  Bottom 0.152: v3.94,6.48 3.94,5.97 | 3.94,5.97 3.94,5.72 | 3.94,5.72 3.94,5.46 | 3.94,5.46 3.94,4.19 2.16,2.41 | 4.19,5.72 9.02,5.72 9.78,6.48 19.56,6.48 v20.96,5.08 20.96,4.95 | 4.19,5.72 3.94,5.72 | 4.19,5.72 3.94,5.97 | 4.19,5.72 3.94,5.46 | 23.24,2.41 20.96,4.7 | 20.96,4.7 20.83,4.83 | v17.78,4.7 17.91,4.83 20.83,4.83 | 20.96,4.95 20.96,4.7 | 20.83,4.83 20.96,4.95
  Bottom 0.305: J3.3 J3.4 1.26,1.52 2.16,2.41 | J5.1 J5.6 24.16,1.62 24.04,1.62 23.24,2.41
INT1  (via drill 0.3 pad 0.64)
  Top 0.152: R8.1 13.47,16.78 v13.33,16.64 | J2.5 1.35,10.46 v1.65,10.16 1.35,9.86 J2.7 | J1.5 24.05,9.86 v23.75,10.16 24.05,10.46 J1.7 | U6.6 15.3,13.15 v14.99,13.46
  Bottom 0.152: 1.91,13.59 2.41,13.08 2.41,10.92 | 11.3,8.76 7.11,8.76 5.08,10.79 2.54,10.79 | 11.3,8.76 11.56,8.76 | 11.56,8.76 11.81,8.76 | 11.81,8.76 12.7,8.76 13.08,9.14 17.53,9.14 18.29,9.91 23.5,9.91 v23.75,10.16 23.24,10.67 23.24,13.21 23.5,13.46 | v13.33,16.64 13.33,13.72 | 13.33,13.72 13.33,13.46 | 13.33,13.46 13.33,13.21 | 13.33,13.21 13.33,11.43 11.56,9.65 11.56,9.02 | 11.56,9.02 11.56,8.76 | 11.56,9.02 11.3,8.76 | 11.56,9.02 11.81,8.76 | v1.65,10.16 2.29,10.79 | 2.29,10.79 2.41,10.92 | 2.54,10.79 2.41,10.79 | 2.41,10.79 2.29,10.79 | 2.41,10.92 2.41,10.79 | 2.41,10.92 2.54,10.79 | v14.99,13.46 13.59,13.46 | 13.59,13.46 13.33,13.46 | 13.59,13.46 13.33,13.72 | 13.59,13.46 13.33,13.21
  Bottom 0.305: 1.91,13.59 1.26,14.23 J4.4 J4.3 | 23.5,13.46 24.16,14.13 J6.6 J6.1
INT2  (via drill 0.3 pad 0.64)
  Top 0.152: R7.1 13.14,13.59 13.97,13.59 14.65,12.91 U6.7 14.65,11.05 15.24,10.46 v15.24,8.51 | J2.6 v4.7,10.16 4.7,13.33 2.03,16 | 23.37,16 22.23,14.86 22.23,13.59 20.57,11.94 20.57,10.41 | J1.6 20.83,10.16 | 20.83,10.16 20.57,10.16 | 20.57,10.16 20.32,10.16 | 20.32,10.16 20.19,10.16 v19.3,9.27 | 20.57,10.16 20.57,10.41 | 20.57,10.41 20.32,10.16 | 20.57,10.41 20.83,10.16
  Top 0.305: 2.03,16 1.49,16.55 J4.5 J4.2 | 23.37,16 23.91,16.55 J6.5 J6.2
  Bottom 0.152: v4.7,10.16 6.48,8.38 15.11,8.38 v15.24,8.51 15.49,8.76 17.65,8.76 18.42,9.53 19.05,9.53 v19.3,9.27
N$1  (via drill 0.3 pad 0.64)
  Top 0.152: U1.9 5.47,17.91 4.32,16.76 v4.32,16.51 | R6.2 11.38,16.59 10.79,16 v9.65,16
  Bottom 0.152: v9.65,16 9.14,16.51 v4.32,16.51
N$2
  Top 0.254: U6.2 17.9,12.69 19.12,13.91 X1.3
N$3
  Top 0.152: R4.1 11.21,7.96 10.29,8.89 R5.1 9.81,9.02 7.4,11.43 U5.3
N$4
  Top 0.254: X1.1 16.72,13.38 17.25,12.85 U6.3
N$6
  Top 0.152: U6.1 18.55,12.7 19.05,13.21 19.69,13.21 20.45,13.97 | R2.2 20.45,13.97 | R3.1 20.51,14.03 20.45,13.97
N$7
  Top 0.152: R15.2 19.62,4.83 19.3,4.83 18.55,5.58 U6.20
N$8
  Top 0.152: U6.19 17.9,5.41 19.16,4.14 R16.2
PA2  (via drill 0.3 pad 0.61, 0.3 pad 0.64)
  Top 0.152: R6.1 11.46,18.26 12.36,17.36 R14.1 12.42,16.66 v12.45,16.64 | U6.8 14,12.8 13.59,13.21 12.64,13.21 v12.45,13.4
  Bottom 0.152: v12.45,16.64 v12.45,13.4
PA3  (via drill 0.3 pad 0.61, 0.3 pad 0.64)
  Top 0.152: U1.8 v5.85,19.3 v5.84,19.3 | R13.1 10.3,16.65 v10.29,16.64 | U6.9 13.35,12.69 13.21,12.83 v10.29,12.83
  Bottom 0.152: v10.29,12.83 v10.29,16.64 9.78,17.15 8,17.15 v5.84,19.3
PA5  (via drill 0.3 pad 0.64)
  Top 0.152: U6.11 12.71,8.94 v12.19,9.46 | U4.5 18.52,17.55 v18.42,17.65
  Bottom 0.152: 12.25,9.4 v12.19,9.46 12.25,9.53 17.43,9.53 20.83,12.92 20.83,15.59 18.76,17.65 v18.42,17.65
PA6
  Top 0.152: U6.12 13.36,9.3 12.63,10.03 11.56,10.03 11.18,9.65 R5.2
SSCL  (via drill 0.3 pad 0.64)
  Top 0.152: R1.1 12.83,4.57 v13.21,4.95 13.59,4.95 14.01,5.38 U6.13 14.01,9.61 v13.46,10.16 13.21,10.41 9.03,10.41 8.05,11.4 U5.2 8.05,13.16 7.05,14.16 U1.14 | U4.4 18.45,16.6 v18.42,16.64
  Bottom 0.152: v13.46,10.16 13.78,9.84 17.28,9.84 20.45,13.01 20.45,15.38 19.19,16.64 v18.42,16.64 | v13.21,4.95 13.21,4.45 11.62,2.86 7.02,2.86 SSCL_TP.T
SSDA  (via drill 0.3 pad 0.64)
  Top 0.152: R12.1 13.88,4.61 14.1,4.83 v14.35,4.83 14.66,5.14 U6.14 14.66,10.1 v14.22,10.54 13.97,10.79 9.27,10.79 8.7,11.37 U5.1 8.7,13.4 v8.64,13.46 | v6.48,13.46 6.48,14.48 6.24,14.71 U1.13 | U4.6 18.38,18.5 17.78,17.91 v17.78,17.15
  Bottom 0.152: v8.64,13.46 v6.48,13.46 | v17.78,17.15 17.78,16.38 18.16,16 19.25,16 20.07,15.19 20.07,13.08 17.21,10.22 14.54,10.22 v14.22,10.54 | v14.35,4.83 12.06,2.54 6.6,2.54 SSDA_TP.T
SWCLK  (via drill 0.3)
  Top 0.152: R15.1 20.27,3.25 18.16,1.14 13.33,1.14 12.83,1.65 v11.94,1.65
  Bottom 0.152: J7.3 v11.94,1.65
SWIO  (via drill 0.3)
  Top 0.152: R16.1 18.63,2.67 16.26,2.67 v15.49,1.91
  Bottom 0.152: J7.4 15.24,1.65 v15.49,1.91
VIN  (via drill 0.3 pad 0.61, 0.3 pad 0.64)
  Top 0.305: J2.2 3.23,11.36 2.79,10.92 2.79,9.4 | 2.92,9.27 2.92,8.89 | J2.10 3.37,8.96 | 3.37,8.96 3.23,8.96 | 3.23,8.96 2.92,9.27 | 3.23,8.96 2.99,8.96 2.92,8.89 | 2.92,8.89 2.92,8.64 | 3.37,8.96 3.05,8.64 | 2.79,9.4 2.79,8.76 | 2.92,9.27 2.79,9.4 | J1.10 22.04,11.36 22.73,10.67 22.73,9.21 | 22.73,9.21 22.73,8.76 | J1.2 22.49,8.96 | 22.49,8.96 22.54,8.96 22.73,8.76 | 22.73,8.76 22.73,8.38 22.23,7.87 v21.97,7.87 | 22.49,8.96 22.73,9.21
  Top 0.61: J3.6 2.74,6.02 2.92,5.84 | 2.92,5.84 3.28,5.49 C3.2 4.55,5.31 C2.2 | C2.2 7.65,5.31 U3.3 | 2.92,8.64 2.92,6.6 | 2.92,6.6 2.92,5.84 | 2.92,6.6 2.41,6.1 | C2.2 5.68,6.69 v5.71,6.73
  Bottom 0.61: v5.71,6.73 6.6,7.62 15.75,7.62 16.19,8.06 21.78,8.06 v21.97,7.87 23.82,6.02 J5.4 J5.3 | J3.6 J3.1

### Text on the board
tPlace: 6 | 6 | 5 | 5 | 4 | 4 | 3 | 3 | 2 | 2 | 1 | 1
bPlace: GND | GND | INT2 | INT2 | INT1 | INT1 | Xadow Basic Sensors | v1.0 10/14/2015 | by Seeed Studio | www.seeedstudio.com | VCC | VCC | SCL | SCL | SDA | 3V3 | GND | SWCLK | SWIO | !RST | SDA
bNames: X | Y | Z